# Altium schematic sheet driver.SchDoc
size A4
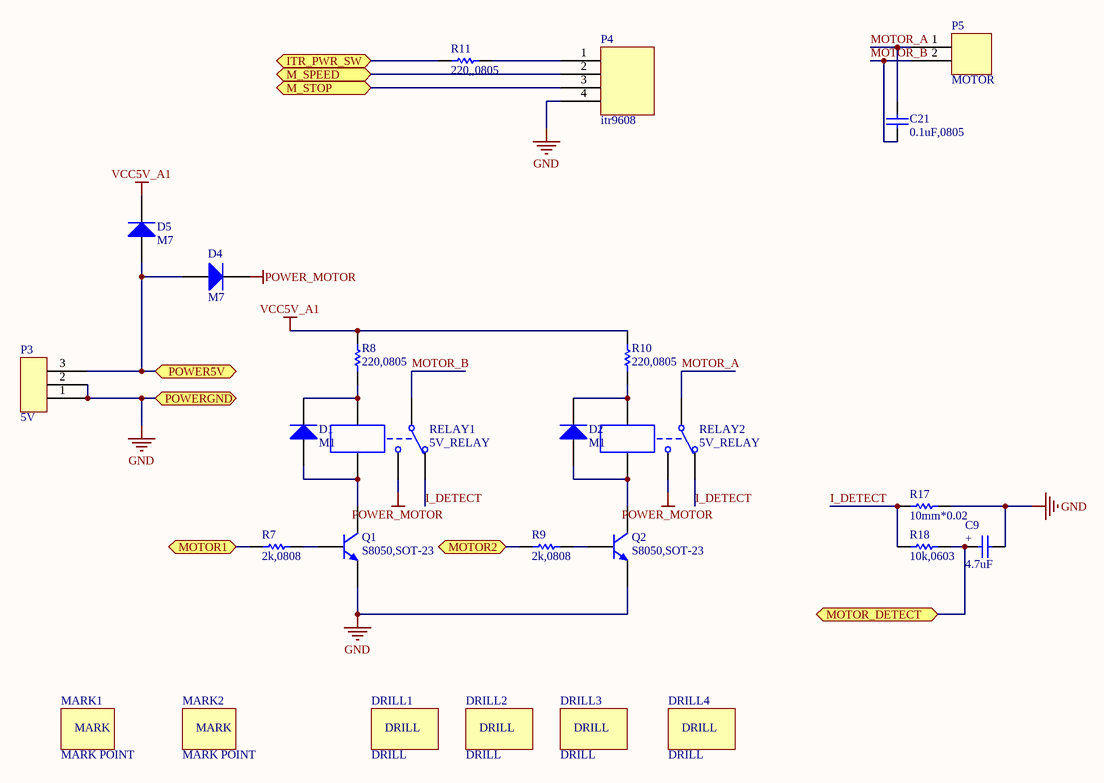
[diagram p0: driver.SchDoc]

## Parts
C9  4.7uF  [CDIP2]
C21  0.1uF,0805  [C0805]
D1  M1  [DO214AC]
D2  M1  [DO214AC]
D4  M7  [DO214AC]
D5  M7  [DO214AC]
DRILL1  DRILL  [DRILL_3MM]
DRILL2  DRILL  [DRILL_3MM]
DRILL3  DRILL  [DRILL_3MM]
DRILL4  DRILL  [DRILL_3MM]
MARK1  MARK POINT  [MARK_POINT]
MARK2  MARK POINT  [MARK_POINT]
P3  5V  [HDR3X1]
P4  itr9608  [HDR4X1]
P5  MOTOR  [HDR2X1]
Q1  S8050,SOT-23  [SOT23]
Q2  S8050,SOT-23  [SOT23]
R7  2k,0808  [R0805]
R8  220,0805  [R0805]
R9  2k,0808  [R0805]
R10  220,0805  [R0805]
R11  220,,0805  [R0805]
R17  10mm*0.02  [Ri]
R18  10k,0603  [R0805]
RELAY1  5V_RELAY  [RELAY_5V_5PIN]
RELAY2  5V_RELAY  [RELAY_5V_5PIN]

## Ports
ITR_PWR_SW, M_SPEED, M_STOP, MOTOR1, MOTOR2, MOTOR_DETECT, POWER5V, POWERGND

## Nets
GND: C9.2 P3.1 P3.2 P4.4 Q1.3(E) Q2.3(E) R17.2 ; port POWERGND
POWER_MOTOR: D4.2(K) RELAY1.3 RELAY2.3
VCC5V_A1: D5.2(K) R8.2 R10.2
I_DETECT: R17.1 R18.1 RELAY1.2 RELAY2.2
ITR_PWR_SW: R11.2 ; port ITR_PWR_SW
M_SPEED: P4.2 ; port M_SPEED
M_STOP: P4.3 ; port M_STOP
MOTOR1: R7.2 ; port MOTOR1
MOTOR2: R9.1 ; port MOTOR2
MOTOR_A: C21.1 P5.1 RELAY2.1
MOTOR_B: C21.2 P5.2 RELAY1.1
MOTOR_DETECT: C9.1 R18.2 ; port MOTOR_DETECT
POWER5V: D4.1(A) D5.1(A) P3.3 ; port POWER5V
NetD1_1: D1.1(A) Q1.1(C) RELAY1.5
NetD1_2: D1.2(K) R8.1 RELAY1.4
NetD2_1: D2.1(A) Q2.1(C) RELAY2.5
NetD2_2: D2.2(K) R10.1 RELAY2.4
NetP4_1: P4.1 R11.1
NetQ1_2: Q1.2(B) R7.1
NetQ2_2: Q2.2(B) R9.2

## Notes on the sheet
- (in symbol E_CAP) +
- (in symbol MARK_POINT) MARK

## Library data of the parts
C9 = E_CAP: electric capacitor; value: 47uF
C21 = CAP: Capacitor; Published: 8-Jun-2000; Revision: July-2002: Re-released for DXP Platform.; Publisher: Altium Limited; Value: 0.1uF
D1 D2 D4 D5 = DIODE
  D1 D2: value: M1
  D4 D5: value: M7
MARK1 MARK2 = MARK_POINT
P3 = Header 3X1: Header 3X1,3-Pin
P4 = Header 4X1: value: ITR9608
P5 = Header 2X1
Q1 = NPN: transistor; pin to pad: 1>3 2>1 3>2; value: s8050
Q2 = NPN: pin to pad: 1>3 2>1 3>2
R7 R9 R18 = Res1: Resistor; Published: 8-Jun-2000; Revision: July-2002: Re-released for DXP Platform.; Publisher: Altium Limited
  R7 R9: value: 2k
  R18: value: 10k
R8 R10 R11 = Res1: Resistor; value: 220; Published: 8-Jun-2000; Revision: July-2002: Re-released for DXP Platform.; Publisher: Altium Limited
R17 = Ri
RELAY1 RELAY2 = RELAY: value: 5V/10A250VAC/10A30VDC